# EAGLE design teensy-boom-jr (EAGLE 7.3.0)
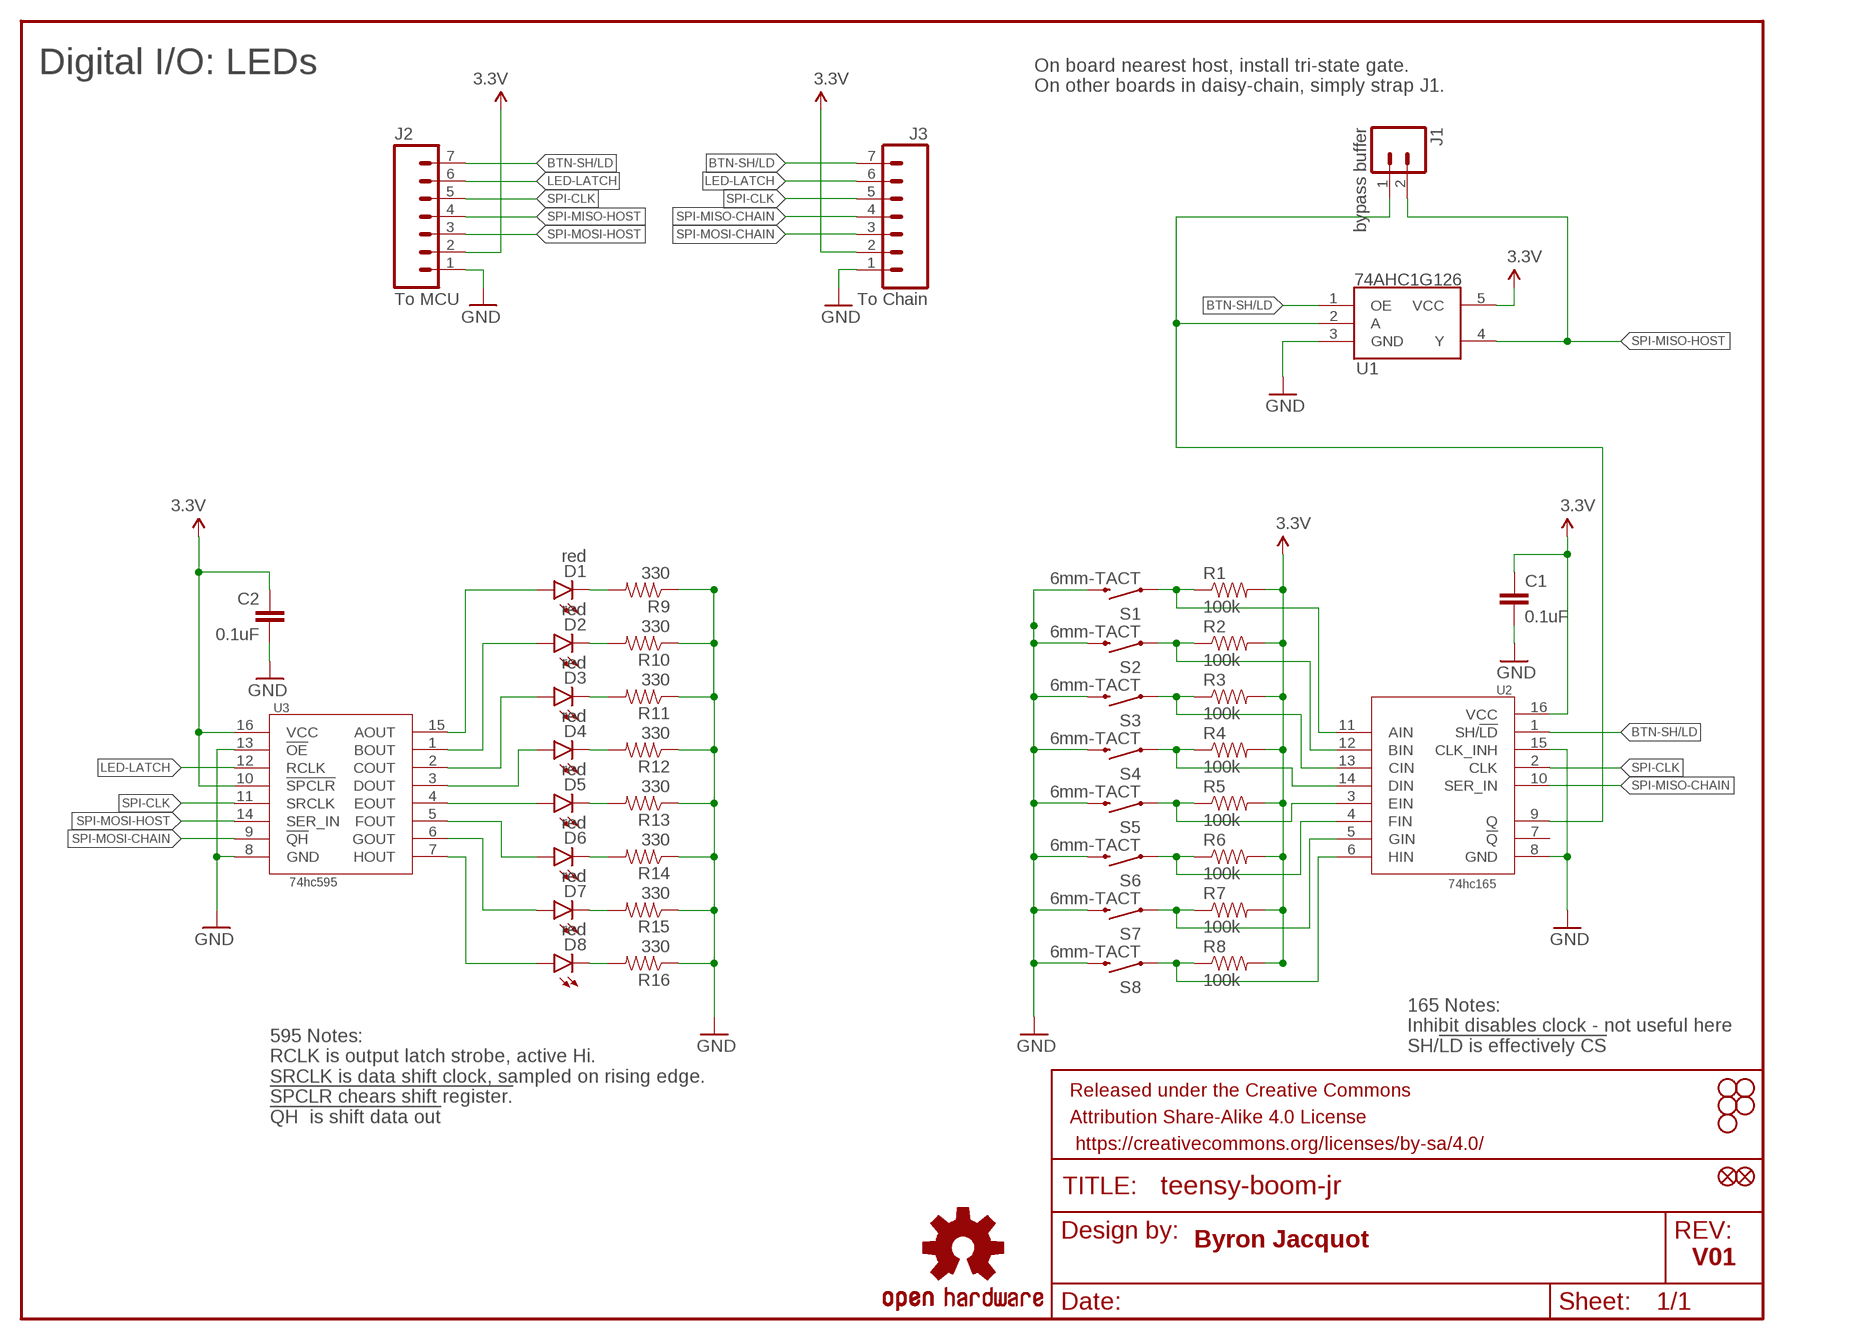
[diagram p0: schematic, sheet 1]

## Parts
C1  0.1uF  0.1UF-25V-5%(0603)  [0603-CAP]
C2  0.1uF  0.1UF-25V-5%(0603)  [0603-CAP]
D1  red  LED-3MM-NO_SILK  [LED3MM-NS]
D2  red  LED-3MM-NO_SILK  [LED3MM-NS]
D3  red  LED-3MM-NO_SILK  [LED3MM-NS]
D4  red  LED-3MM-NO_SILK  [LED3MM-NS]
D5  red  LED-3MM-NO_SILK  [LED3MM-NS]
D6  red  LED-3MM-NO_SILK  [LED3MM-NS]
D7  red  LED-3MM-NO_SILK  [LED3MM-NS]
D8  red  LED-3MM-NO_SILK  [LED3MM-NS]
FD1  FIDUCIALUFIDUCIAL  [MICRO-FIDUCIAL]
FD2  FIDUCIALUFIDUCIAL  [MICRO-FIDUCIAL]
FRAME1  FRAME-LETTER  [CREATIVE_COMMONS]
H1  STAND-OFF  [STAND-OFF]
H2  STAND-OFF  [STAND-OFF]
H3  STAND-OFF  [STAND-OFF]
H4  STAND-OFF  [STAND-OFF]
H5  STAND-OFF  [STAND-OFF]
J1  bypass buffer  M021X02_NO_SILK  [1X02_NO_SILK]
J2  To MCU  M07NO_SILK  [1X07_NO_SILK]
J3  To Chain  M07NO_SILK  [1X07_NO_SILK]
LOGO1  OSHW-LOGOS  [OSHW-LOGO-S]
R1  100k  RESISTOR0805-RES  [0805]
R2  100k  RESISTOR0805-RES  [0805]
R3  100k  RESISTOR0805-RES  [0805]
R4  100k  RESISTOR0805-RES  [0805]
R5  100k  RESISTOR0805-RES  [0805]
R6  100k  RESISTOR0805-RES  [0805]
R7  100k  RESISTOR0805-RES  [0805]
R8  100k  RESISTOR0805-RES  [0805]
R9  330  330OHM1/10W1%(0603)  [0603-RES]
R10  330  330OHM1/10W1%(0603)  [0603-RES]
R11  330  330OHM1/10W1%(0603)  [0603-RES]
R12  330  330OHM1/10W1%(0603)  [0603-RES]
R13  330  330OHM1/10W1%(0603)  [0603-RES]
R14  330  330OHM1/10W1%(0603)  [0603-RES]
R15  330  330OHM1/10W1%(0603)  [0603-RES]
R16  330  330OHM1/10W1%(0603)  [0603-RES]
S1  6mm-TACT  SWITCH-MOMENTARY-212MM  [TACTILE-PTH-12MM]
S2  6mm-TACT  SWITCH-MOMENTARY-212MM  [TACTILE-PTH-12MM]
S3  6mm-TACT  SWITCH-MOMENTARY-212MM  [TACTILE-PTH-12MM]
S4  6mm-TACT  SWITCH-MOMENTARY-212MM  [TACTILE-PTH-12MM]
S5  6mm-TACT  SWITCH-MOMENTARY-212MM  [TACTILE-PTH-12MM]
S6  6mm-TACT  SWITCH-MOMENTARY-212MM  [TACTILE-PTH-12MM]
S7  6mm-TACT  SWITCH-MOMENTARY-212MM  [TACTILE-PTH-12MM]
S8  6mm-TACT  SWITCH-MOMENTARY-212MM  [TACTILE-PTH-12MM]
U1  74AHC1G126  [SOT23-5]
U2  74hc165  74HC165  [SO16]
U3  74hc595  74HC595  [SO16]

## Nets
3.3V: C1.1 C2.1 J2.2 J3.2 R1.2 R2.2 R3.2 R4.2 R5.2 R6.2 R7.2 R8.2 U1.5(VCC) U2.16(VCC) U3.10(!SPCLR) U3.16(VCC)
BTN-SH/LD: J2.7 J3.7 U1.1(OE) U2.1(SH/!LD)
GND: C1.2 C2.2 J2.1 J3.1 R9.1 R10.1 R11.1 R12.1 R13.1 R14.1 R15.1 R16.1 S1.3 S2.3 S3.3 S4.3 S5.3 S6.3 S7.3 S8.3 U1.3(GND) U2.8(GND) U2.15(CLK_INH) U3.8(GND) U3.13(!OE)
LED-LATCH: J2.6 J3.6 U3.12(RCLK)
N$1: R1.1 S1.1 U2.11(AIN)
N$3: R2.1 S2.1 U2.12(BIN)
N$4: R3.1 S3.1 U2.13(CIN)
N$5: R4.1 S4.1 U2.14(DIN)
N$6: D8.K(C) R16.2
N$7: R5.1 S5.1 U2.3(EIN)
N$8: R6.1 S6.1 U2.4(FIN)
N$9: R7.1 S7.1 U2.5(GIN)
N$10: D7.K(C) R15.2
N$11: D6.K(C) R14.2
N$12: D5.K(C) R13.2
N$13: D4.K(C) R12.2
N$14: D3.K(C) R11.2
N$15: D2.K(C) R10.2
N$16: D1.K(C) R9.2
N$17: R8.1 S8.1 U2.6(HIN)
N$19: J1.1 U1.2(A) U2.9(Q)
N$34: D4.A U3.3(DOUT)
N$35: D5.A U3.4(EOUT)
N$36: D6.A U3.5(FOUT)
N$37: D7.A U3.6(GOUT)
N$38: D8.A U3.7(HOUT)
N$39: D3.A U3.2(COUT)
N$40: D2.A U3.1(BOUT)
N$41: D1.A U3.15(AOUT)
SPI-CLK: J2.5 J3.5 U2.2(CLK) U3.11(SRCLK)
SPI-MISO-CHAIN: J3.4 U2.10(SER_IN)
SPI-MISO-HOST: J1.2 J2.4 U1.4(Y)
SPI-MOSI-CHAIN: J3.3 U3.9(!QH)
SPI-MOSI-HOST: J2.3 U3.14(SER_IN)
Unconnected: U2.7(!Q)

## Notes on the sheet
- Digital I/O: LEDs
- On board nearest host, install tri-state gate.
  On other boards in daisy-chain, simply strap J1.
- 165 Notes:
  Inhibit disables clock - not useful here
  SH/!LD is effectively CS
- 595 Notes:
  RCLK is output latch strobe, active Hi.
  SRCLK is data shift clock, sampled on rising edge.
  !SPCLR chears shift register.
  !QH  is shift data out
- Byron Jacquot
- V01

## Library data of the parts
C1 C2 = SparkFun-Capacitors:0.1UF-25V-5%(0603): CAP-08604; PROD_ID: CAP-08604
D1-D8 = SparkFun-LED:LED: LEDs Standard schematic elements and footprints for 5mm, 3mm, 1206, and 0603 sized LEDs. 5mm - Spark Fun Electronics SKU : COM-00529 (and others)
FD1 FD2 = SparkFun-Aesthetics:FIDUCIAL: Fiducial Alignment Points Various fiducial points for machine vision alignment.
FRAME1 = SparkFun-Aesthetics:FRAME-LETTER: Schematic Frame Standard 8.5x11 US Letter frame
H1-H5 = SparkFun-Electromechanical:STAND-OFF: #4 Stand Off This is the mechanical footprint for a #4 phillips button head screw. Use the keepout ring to avoid running the screw head into surrounding components. SKU : PRT-00447
J1 = SparkFun-Connectors:M02: Standard 2-pin 0.1" header. Use with - straight break away headers ( PRT-00116) - right angle break away headers (PRT-00553) - swiss pins (PRT-00743) - machine pins (PRT-00117) - female headers (PRT-00115) Molex polarized connector foot print use with: PRT-08233 with associated crimp pins and housings. 2.54_SCREWTERM for use with PRT-10571. 3.5mm Screw Terminal footprints for PRT-08084 5mm Screw Terminal footprints for use with PRT-08432
J2 J3 = SparkFun-Connectors:M07: Header 7 Standard 7-pin 0.1" header. Use with straight break away headers (SKU : PRT-00116), right angle break away headers (PRT-00553), swiss pins (PRT-00743), machine pins (PRT-00117), and female headers (PRT-00115). NOTES ON THE VARIANTS LOCK and LOCK_LONGPADS... This footprint was designed to help hold the alignment of a through-hole component (i.e. 7-pin header) while soldering it into place. You may notice that each hole has been shifted either up or down by 0.005 of an inch from it's more standard position (which is usually a perfectly straight line). This slight alteration caused the pins (the squares in the middle) to touch the edges of the holes. Because they are alternating, it causes a "brace" to hold the header in place. 0.005 has proven to be the perfect amount of "off-center" position when using our standard breakaway headers. Although looks a little odd when you look at the bare footprint, once you have a header in there, the alteration is very hard to notice. Also, if you push a header all the way into place, it is covered up entirely on the bottom side. This idea of altering the position of holes to aid alignment will be further integrated into the Sparkfun Library for other footprints. It can help hold any component with 3 or more connection pins.
LOGO1 = SparkFun-Aesthetics:OSHW-LOGO: Open Source Hardware Logo This logo indicates the piece of hardware it is found on incorporates a OSHW license and/or adheres to the definition of open source hardware found here: http://freedomdefined.org/OSHW
R1-R8 = SparkFun-Resistors:RESISTOR: Resistor Basic schematic elements and footprints for 0603, 1206, and PTH resistors.
R9-R16 = SparkFun-Resistors:330OHM1/10W1%(0603): RES-00818; PROD_ID: RES-00818
S1-S8 = SparkFun-Electromechanical:SWITCH-MOMENTARY-2: Various NO switches- pushbuttons, reed, etc; PROD_ID: SWCH-09185
U1 = teensy-synth:74AHC1G126
U2 = teensy-synth:74HC165
U3 = teensy-synth:74HC595

## Board
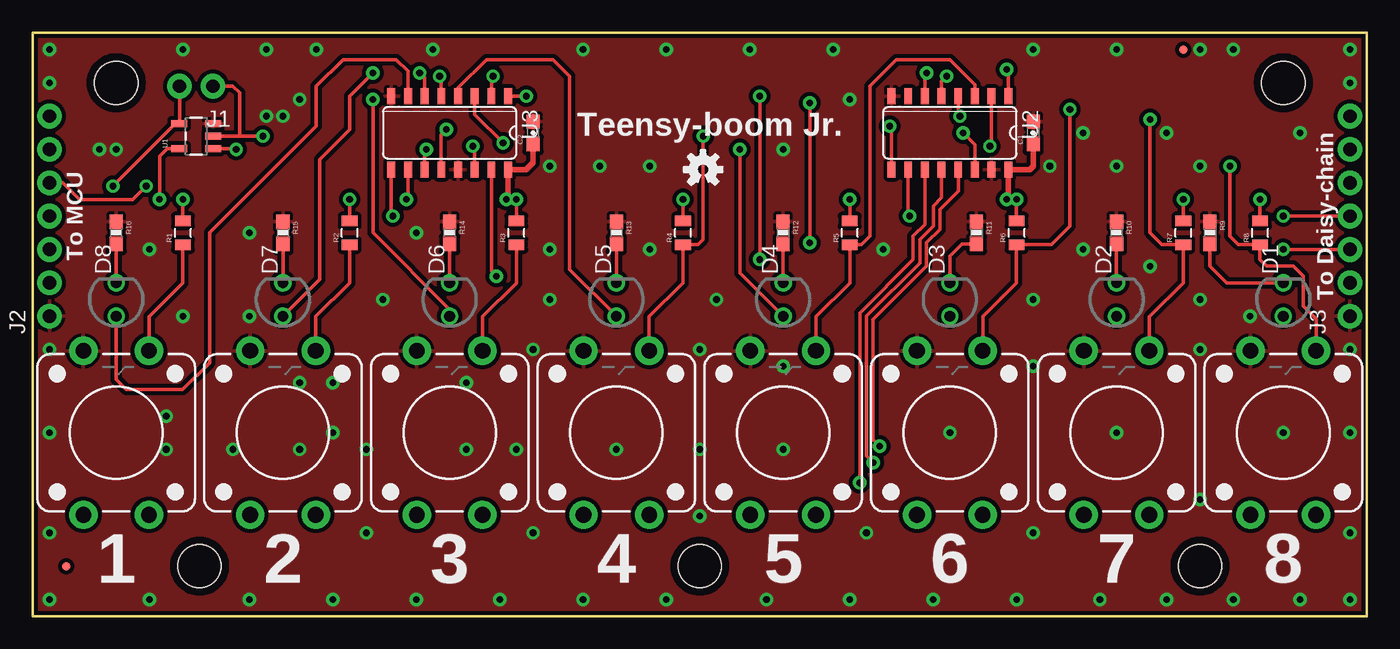
[diagram p1: board, top side]
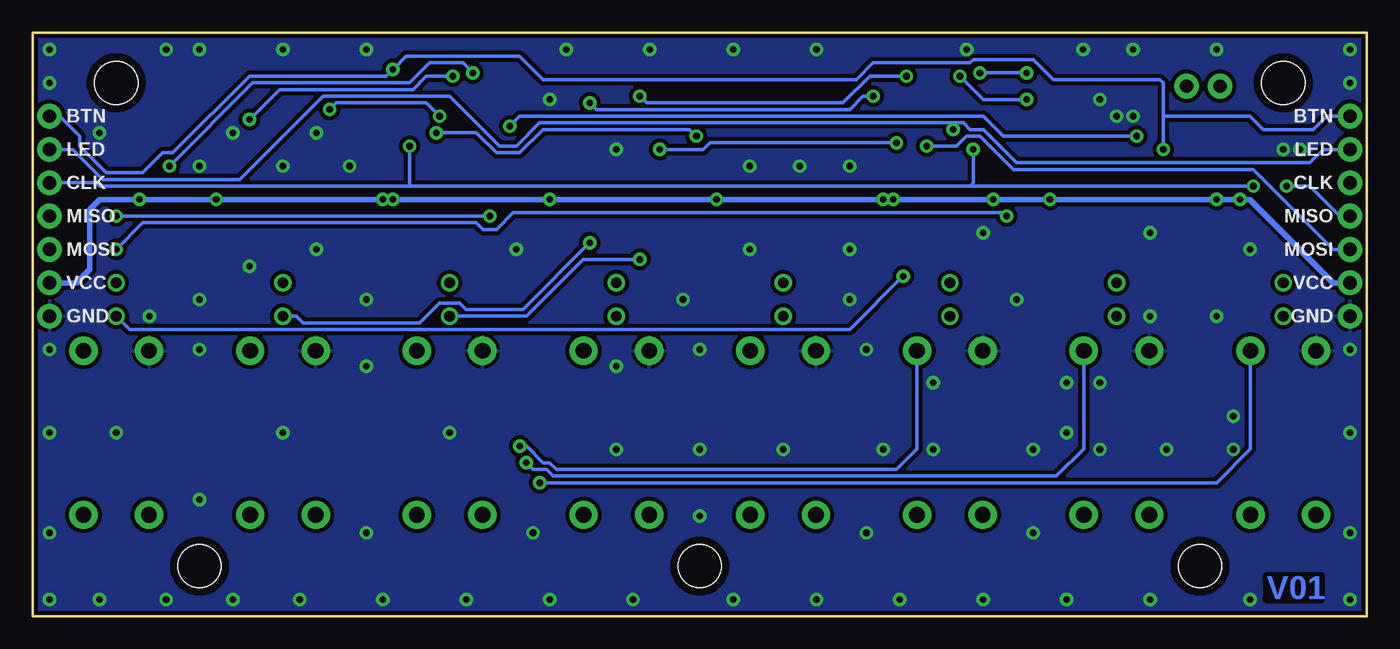
[diagram p2: board, bottom side, seen from below]

Size 101.6 x 44.45 mm. Coordinates in mm from the lower left corner, seen from the top.
Outline: 0,0 101.6,0 101.6,44.45 0,44.45 0,0
Copper layers (1*16): Top 0.035mm / dielectric 1.5mm / Bottom 0.035mm
Design rules "SparkFun-2-layer-STANDARD": minimum track width 10mil, minimum drill 20mil, track to track 10mil, track to pad 8mil, pad to pad 8mil, via to via 10mil, smd to smd 8mil, copper to edge 8mil, drill to drill 8mil, minimum pad ring 10mil, minimum via ring 10mil, stop-mask expansion 4mil, vias tented up to drill 20mil, thermal gap 10mil

### Footprints (pad centres in the part's own frame; a part is rotated, then mirrored left to right if it is on the bottom)
0603-CAP = smd 1.1 x 1: 1 -0.85,0; 2 0.85,0
LED3MM-NS = drill 0.813: A -1.27,0; K 1.27,0
MICRO-FIDUCIAL = smd 0.635 x 0.635: 1 0,0
STAND-OFF = hole 3.302: 0,0
1X02_NO_SILK = drill 1.016 pad 1.88: 1 0,0; 2 2.54,0
1X07_NO_SILK = drill 1.016 pad 1.88: 1 0,0; 2 2.54,0; 3 5.08,0; 4 7.62,0; 5 10.16,0; 6 12.7,0; 7 15.24,0
0805 = smd 0.8 x 1.2: 1 -0.9,0; 2 0.9,0
0603-RES = smd 1.1 x 1: 1 -0.85,0; 2 0.85,0
TACTILE-PTH-12MM = drill 1.2 pad 2.159: 1 6.25,-2.5; 2 -6.25,-2.5; 3 6.25,2.5; 4 -6.25,2.5
SOT23-5 = smd 0.55 x 1.2: 1 -0.95,-1.3; 2 0,-1.3; 3 0.95,-1.3; 4 0.95,1.3; 5 -0.95,1.3
SO16 = smd 1.2 x 0.6: 1 -2.8,4.445; 2 -2.8,3.175; 3 -2.8,1.905; 4 -2.8,0.635; 5 -2.8,-0.635; 6 -2.8,-1.905; 7 -2.8,-3.175; 8 -2.8,-4.445; 9 2.8,-4.445; 10 2.8,-3.175; 11 2.8,-1.905; 12 2.8,-0.635; 13 2.8,0.635; 14 2.8,1.905; 15 2.8,3.175; 16 2.8,4.445

### Placement (x,y rotation side)
C1  76.2,36.83 90 top
C2  38.1,36.83 90 top
D1  95.25,24.13 90 top
D2  82.55,24.13 90 top
D3  69.85,24.13 90 top
D4  57.15,24.13 90 top
D5  44.45,24.13 90 top
D6  31.75,24.13 90 top
D7  19.05,24.13 90 top
D8  6.35,24.13 90 top
FD1  2.54,3.81 0 top
FD2  87.63,43.18 0 top
FRAME1  19.05,-7.62 0 top  (outside the outline)
H1  6.35,40.64 0 top
H2  12.7,3.81 0 top
H3  88.9,3.81 0 top
H4  95.25,40.64 0 top
H5  50.8,3.81 0 top
J1  13.72,40.39 180 top
J2  1.27,22.86 90 top
J3  100.33,22.86 90 top
LOGO1  51.05,34.04 0 top
R1  11.43,29.21 90 top
R2  24.13,29.21 90 top
R3  36.83,29.21 90 top
R4  49.53,29.21 90 top
R5  62.23,29.21 90 top
R6  74.93,29.21 90 top
R7  87.63,29.21 90 top
R8  93.47,29.21 90 top
R9  89.66,29.21 270 top
R10  82.55,29.21 270 top
R11  71.88,29.21 270 top
R12  57.15,29.21 270 top
R13  44.45,29.21 270 top
R14  31.75,29.21 270 top
R15  19.05,29.21 270 top
R16  6.35,29.21 270 top
S1  6.35,13.97 90 top
S2  19.05,13.97 90 top
S3  31.75,13.97 90 top
S4  44.45,13.97 90 top
S5  57.15,13.97 90 top
S6  69.85,13.97 90 top
S7  82.55,13.97 90 top
S8  95.25,13.97 90 top
U1  12.45,36.58 90 top
U2  69.85,36.83 270 top
U3  31.75,36.83 270 top

### Tracks (layer width: path | path; a pad name or v marks a point on that pad's centre or on a via)
3.3V  (via drill 0.51)
  Top 0.254: R2.2 v24.13,31.75 | U3.10 28.57,31.88 v28.45,31.75 | R3.2 v36.83,31.75 | R7.2 v87.63,31.75 | R8.2 v93.47,31.75 | R5.2 v62.23,31.75 | R4.2 v49.53,31.75 | R1.2 v11.43,31.75 | U1.5 10.23,35.63 9.65,35.05 v9.65,31.75 | R6.2 v74.93,31.75
  Top 0.406: v36.07,31.75 36.2,31.88 U3.16 37.59,34.03 38.1,34.54 C2.1 | v74.17,31.75 74.3,31.88 U2.16 75.94,34.03 76.2,34.29 C1.1
  Bottom 0.406: J2.2 2.54,25.4 8.89,31.75 v9.65,31.75 v11.43,31.75 v24.13,31.75 v28.45,31.75 v36.07,31.75 v36.83,31.75 v49.53,31.75 v62.23,31.75 v74.17,31.75 v74.93,31.75 v87.63,31.75 v93.47,31.75 96.52,31.75 97.28,30.99 97.28,26.42 98.3,25.4 J3.2
BTN-SH/LD  (via drill 0.51)
  Top 0.254: U1.1 15.43,35.63 v15.49,35.56 | U2.1 74.3,41.53 v74.17,41.66
  Bottom 0.254: 15.49,38.1 8.89,38.1 7.87,37.08 4.06,37.08 3.05,38.1 J2.7 | v15.49,35.56 15.49,38.1 | 15.49,38.1 15.49,40.64 15.75,40.89 23.88,40.89 25.4,42.42 29.97,42.42 30.23,42.16 37.59,42.16 38.86,40.89 62.74,40.89 64.52,42.67 73.15,42.67 v74.17,41.66 74.68,41.15 85.09,41.15 90.93,35.31 91.69,35.31 93.22,33.78 96.01,33.78 98.04,35.81 98.04,36.58 99.57,38.1 J3.7
GND  (via drill 0.51)
  other vias: 1.27,1.27 8.89,1.27 16.51,1.27 22.86,1.27 29.21,1.27 35.56,1.27 41.91,1.27 48.26,1.27 55.88,1.27 62.23,1.27 68.58,1.27 74.93,1.27 81.28,1.27 86.36,1.27 91.44,1.27 100.33,1.27 96.52,1.27 100.33,6.35 76.2,6.35 63.5,6.35 50.8,7.62 38.1,6.35 25.4,6.35 1.27,6.35 1.27,13.97 1.27,20.32 1.27,40.64 1.27,43.18 11.43,43.18 17.78,43.18 30.48,43.18 21.59,43.18 41.91,43.18 48.26,43.18 54.61,43.18 60.96,43.18 76.2,43.18 82.55,43.18 88.9,43.18 91.44,43.18 100.33,43.18 100.33,40.64 96.52,36.83 86.36,36.83 88.9,34.29 82.55,34.29 80.01,36.83 77.47,34.29 39.37,34.29 43.18,34.29 46.99,34.29 57.15,35.56 62.23,39.37 20.32,39.37 17.78,38.1 19.05,38.1 5.08,35.56 6.35,35.56 20.32,17.78 10.16,15.24 15.24,12.7 20.32,12.7 10.16,12.7 22.86,17.78 22.86,13.97 25.4,12.7 33.02,12.7 33.02,17.78 26.67,24.13 39.37,24.13 52.07,24.13 36.83,12.7 38.1,20.32 44.45,12.7 57.15,12.7 50.8,12.7 69.85,13.97 82.55,13.97 95.25,13.97 100.33,20.32 76.2,19.05 76.2,24.13 80.01,27.94 85.09,26.67 88.9,24.13 92.71,22.86 64.77,27.94 46.99,27.94 39.37,27.94 29.21,29.21 16.51,29.21 16.51,22.86 11.43,22.86 8.89,27.94 88.9,8.89 88.9,20.32 57.15,19.05 50.8,20.32 100.33,13.97
  pour Top (isolate 0.305): 0,0 101.6,0 101.6,44.45 0,44.45
  pour Bottom (isolate 0.305): 101.6,0 0,0 0,44.45 101.6,44.45
LED-LATCH  (via drill 0.51)
  Top 0.254: U3.12 31.11,36.7 v31.5,37.08
  Bottom 0.254: J2.6 3.3,35.56 4.32,34.54 26.67,34.54 29.21,37.08 30.23,37.08 30.73,37.59 31.5,37.59 | 31.5,37.59 62.99,37.59 64.77,35.81 66.04,35.81 69.85,39.62 79.5,39.62 85.85,33.27 96.27,33.27 98.55,35.56 J3.6 | v31.5,37.08 31.5,37.59
N$1  (via drill 0.51)
  Top 0.254: R1.1 11.43,25.4 8.85,22.82 S1.1 | v62.99,10.16 62.99,23.11 67.06,27.18 67.06,28.96 67.94,29.84 U2.11
  Bottom 0.254: S1.1 8.85,12.74 11.43,10.16 v62.99,10.16
N$3  (via drill 0.51)
  Top 0.254: R2.1 24.13,25.4 21.55,22.82 S2.1 | v64.01,11.68 63.5,12.19 63.5,22.86 67.56,26.92 67.56,28.7 68.58,29.72 68.58,31.24 69.22,31.88 U2.12
  Bottom 0.254: S2.1 21.55,12.74 23.62,10.67 61.98,10.67 62.48,11.18 63.5,11.18 v64.01,11.68
N$4  (via drill 0.51)
  Top 0.254: R3.1 36.83,25.4 34.25,22.82 S3.1 | v64.52,12.95 64.01,13.46 64.01,22.61 68.07,26.67 68.07,28.45 69.09,29.46 69.09,30.99 70.48,32.38 U2.13
  Bottom 0.254: S3.1 34.25,12.74 35.81,11.18 61.72,11.18 62.23,11.68 62.74,11.68 64.01,12.95 v64.52,12.95
N$5  (via drill 0.51)
  Top 0.254: S4.1 46.95,22.82 49.53,25.4 R4.1 50.66,28.31 51.05,28.7 v51.05,36.58 | U2.14 71.75,35.94 v70.87,36.83
  Bottom 0.254: v70.87,36.83 67.82,36.83 66.29,35.31 64.52,35.31 62.74,37.08 51.56,37.08 v51.05,36.58
N$6
  Top 0.254: R16.2 D8.K
N$7
  Top 0.254: S5.1 59.65,22.82 62.23,25.4 R5.1 63.11,28.31 63.75,28.96 63.75,40.39 65.79,42.42 69.85,42.42 71.75,40.51 U2.3
N$8  (via drill 0.51)
  Top 0.254: S6.1 72.35,22.82 74.93,25.4 R6.1 77.59,28.31 78.99,29.72 v78.99,38.61 | U2.4 70.48,38.23 v70.61,38.1
  Bottom 0.254: v70.61,38.1 71.63,39.12 78.49,39.12 v78.99,38.61
N$9  (via drill 0.51)
  Top 0.254: S7.1 85.05,22.82 87.63,25.4 R7.1 85.99,28.31 85.09,29.21 v85.09,37.85 | U2.5 69.22,40.77 v69.6,41.15
  Bottom 0.254: v85.09,37.85 82.8,40.13 72.64,40.13 71.63,41.15 v69.6,41.15
N$10
  Top 0.254: R15.2 D7.K
N$11
  Top 0.254: R14.2 D6.K
N$12
  Top 0.254: D5.K R13.2
N$13
  Top 0.254: D4.K R12.2
N$14
  Top 0.254: D3.K 69.85,27.43 70.78,28.36 R11.2
N$15
  Top 0.254: D2.K R10.2
N$16
  Top 0.254: D1.K 90.93,25.4 89.66,26.67 R9.2
N$17  (via drill 0.51)
  Top 0.254: S8.1 97.75,22.65 96.77,23.62 96.77,25.91 96.01,26.67 93.98,26.67 93.47,27.18 R8.1 91.83,28.31 91.19,28.96 v91.19,34.29 | U2.6 67.94,41.27 v68.07,41.4
  Bottom 0.254: v68.07,41.4 68.83,42.16 71.37,42.16 72.9,40.64 84.84,40.64 v91.19,34.29
N$19  (via drill 0.51)
  Top 0.254: J1.1 15.24,40.39 15.75,39.88 15.75,36.58 | 15.75,36.58 U1.2 | 15.75,36.58 v17.53,36.58 | U2.9 65.41,37.21 v65.28,37.34
  Bottom 0.254: v17.53,36.58 27.69,36.58 29.21,38.1 64.52,38.1 v65.28,37.34
N$34  (via drill 0.51)
  Top 0.254: D4.A 53.85,26.16 v53.85,35.56 | U3.3 33.66,38.23 v35.81,36.07
  Bottom 0.254: v35.81,36.07 50.04,36.07 50.55,35.56 v53.85,35.56
N$35
  Top 0.254: D5.A 40.89,26.42 40.89,41.15 39.62,42.42 34.54,42.42 32.38,40.26 U3.4
N$36  (via drill 0.51)
  Top 0.254: D6.A 31.75,23.37 25.91,29.21 v25.91,39.37 | U3.5 31.11,41.02 v30.99,41.15
  Bottom 0.254: v25.91,39.37 29.21,39.37 v30.99,41.15
N$37  (via drill 0.51)
  Top 0.254: D7.A 21.84,25.65 21.84,34.8 24.13,37.08 24.13,39.62 v25.91,41.4 | U3.6 29.84,41.02 v29.46,41.4
  Bottom 0.254: v25.91,41.4 v29.46,41.4
N$38
  Top 0.254: D8.A 6.35,18.03 7.11,17.27 11.43,17.27 13.46,19.3 13.46,29.21 21.59,37.34 21.59,40.39 23.62,42.42 27.69,42.42 28.57,41.53 U3.7
N$39  (via drill 0.51)
  Top 0.254: v55.37,27.18 v55.37,39.62 | U3.2 34.92,41.02 v35.05,41.15
  Bottom 0.254: D3.A 64.01,22.86 59.69,27.18 v55.37,27.18 | v55.37,39.62 54.86,39.12 39.88,39.12 37.85,41.15 v35.05,41.15
N$40  (via drill 0.51)
  Top 0.254: v59.18,28.45 v59.18,39.12 | U3.1 v37.59,39.63 v37.59,39.62
  Bottom 0.254: D2.A 81.53,22.86 81.03,22.35 72.14,22.35 70.61,23.88 69.09,23.88 68.58,23.37 64.26,23.37 v59.18,28.45 | v37.59,39.62 38.35,39.62 39.37,38.61 58.67,38.61 v59.18,39.12
N$41  (via drill 0.51)
  Top 0.254: U3.15 34.92,26.29 v35.31,25.91
  Bottom 0.254: D1.A 94.23,21.84 39.37,21.84 v35.31,25.91
SPI-CLK  (via drill 0.51)
  Top 0.254: J2.5 2.29,33.02 3.56,31.75 7.62,31.75 v8.64,32.77 | U3.11 29.84,35.43 v29.97,35.56 | U2.2 73.03,35.94 v72.9,35.81
  Bottom 0.254: v8.64,32.77 30.23,32.77 | 30.23,32.77 72.9,32.77 | 72.9,32.77 96.52,32.77 96.77,33.02 J3.5 | v29.97,35.56 29.97,33.02 30.23,32.77 | v72.9,35.81 72.9,32.77
SPI-MISO-CHAIN  (via drill 0.51)
  Top 0.254: J3.4 v95.25,30.48 | U2.10 66.67,30.61 v66.8,30.48
  Bottom 0.254: v95.25,30.48 v66.8,30.48
SPI-MISO-HOST  (via drill 0.51)
  Top 0.254: J1.2 11.18,37.56 U1.4 10.86,37.53 v6.1,32.77
  Bottom 0.254: J2.4 2.03,30.48 4.32,32.77 v6.1,32.77
SPI-MOSI-CHAIN  (via drill 0.51)
  Top 0.254: J3.3 v95.25,27.94 | U3.9 27.3,30.61 v27.43,30.48
  Bottom 0.254: v95.25,27.94 93.22,29.97 67.82,29.97 67.31,29.46 66.29,29.46 65.02,30.73 27.69,30.73 v27.43,30.48
SPI-MOSI-HOST  (via drill 0.51)
  Top 0.254: U3.14 33.66,35.69 v33.53,35.81
  Bottom 0.254: v33.53,35.81 31.24,35.81 30.48,36.58 29.46,36.58 26.92,34.04 8.64,34.04 2.54,27.94 J2.3

### Text on the board
Bottom: V01
tPlace: Teensy-boom Jr. | To MCU | To Daisy-chain | 1 | 2 | 3 | 4 | 5 | 6 | 7 | 8
bPlace: BTN | BTN | LED | LED | CLK | CLK | MISO | MISO | MOSI | MOSI | VCC | VCC | GND | GND
tDocu: Byron Jacquot